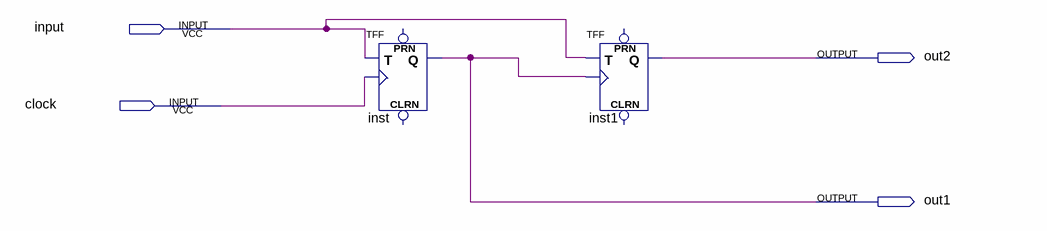
[diagram p0: schematic sheet]
// Quartus schematic 2bitcounter.bdf as structural Verilog: 2 symbols, 4 pins
module \2bitcounter  (
  input  \input ,
  input  clock,
  output out2,
  output out1
);

  TFF inst (.T(\input ), .CLK(clock), .Q(out1));  // open: PRN, CLRN
  TFF inst1 (.T(\input ), .CLK(out1), .Q(out2));  // open: PRN, CLRN
endmodule
